# Altium schematic sheet gydrodrive_rs485.SchDoc
size 297 x 209 mm; SheetNumber: 14; SheetTotal: 22
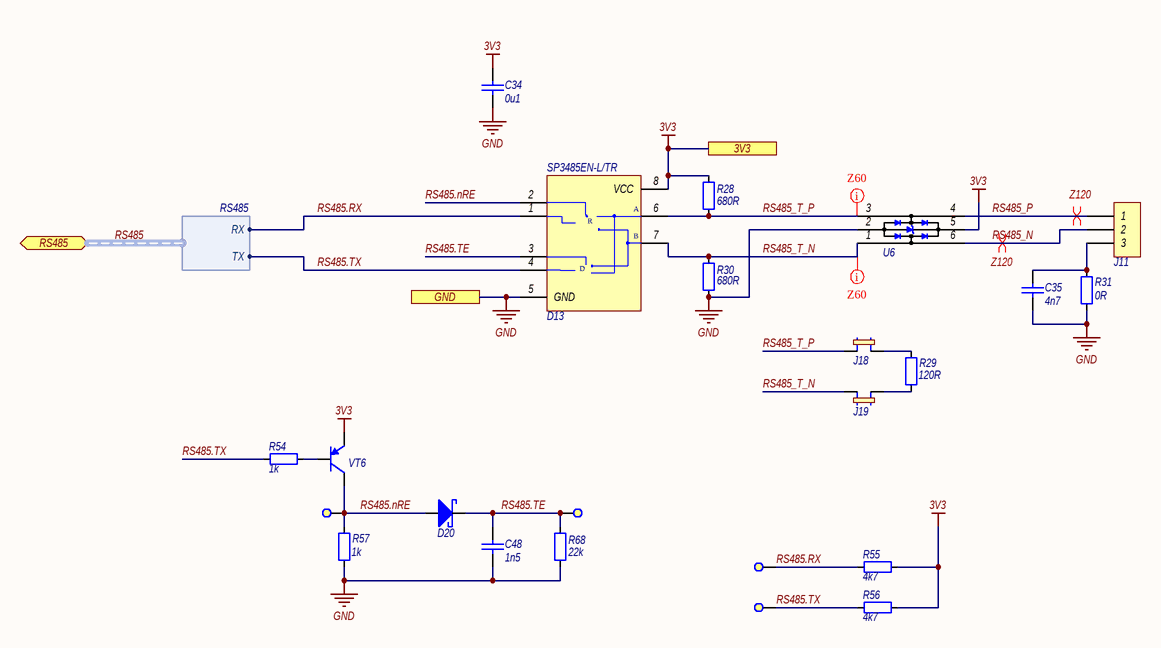
[diagram p0: gydrodrive_rs485.SchDoc]

## Parts
C34  Capacitance: 0u1  [CAPC2012-0805M]  (hidden comment: CAP_0805)
C35  Capacitance: 4n7  [CAPC3216-1206M]  (hidden comment: CAP_1206)
C48  Capacitance: 1n5  [CAPC2012-0805M]  (hidden comment: CAP_0805)
D13  SP3485EN-L/TR  [SO8_M]
D20  MBR0540  [SOD_123_M]  (value not drawn)
J11  DG142V-5.08-03P  [DG142V-5.08-03P]  (value not drawn)
J18  PLS-2.54-2 JUMP  [PLS-2-2.54]  (value not drawn)
J19  PLS-2.54-2 JUMP  [PLS-2-2.54]  (value not drawn)
R28  Resistance: 680R  [RESC3216-1206M]  (hidden comment: RES_1206)
R29  Resistance: 120R  [RESC3216-1206M]  (hidden comment: RES_1206)
R30  Resistance: 680R  [RESC3216-1206M]  (hidden comment: RES_1206)
R31  Resistance: 0R  [RESC3216-1206M]  (hidden comment: RES_1206)
R54  Resistance: 1k  [RESC2012-0805M]  (hidden comment: RES_0805)
R55  Resistance: 4k7  [RESC2012-0805M]  (hidden comment: RES_0805)
R56  Resistance: 4k7  [RESC2012-0805M]  (hidden comment: RES_0805)
R57  Resistance: 1k  [RESC2012-0805M]  (hidden comment: RES_0805)
R68  Resistance: 22k  [RESC2012-0805M]  (hidden comment: RES_0805)
TP1  Test point 1  [TP_1]  (value not drawn)  (no BOM)
TP10  Test point 1  [TP_1]  (value not drawn)  (no BOM)
TP11  Test point 1  [TP_1]  (value not drawn)  (no BOM)
TP19  Test point 1  [TP_1]  (value not drawn)  (no BOM)
U6  USBLC6-2SC6  [SOT23-6AM]  (value not drawn)
VT6  BC807  [SOT23-3M]  (value not drawn)

## Ports
3V3 (see gydrodrive_interfaces[3C], gydrodrive_button[2B], gydrodrive_can[2B], gydrodrive_debugger[2B], gydrodrive_encoder[1A], gydrodrive_indication[3C], gydrodrive_inputTrim[2B], gydrodrive_interfaces[3C], gydrodrive_mcu[4C], gydrodrive_sto[2B], gydrodrive_supply[3C]), GND (see gydrodrive_interfaces[3C], gydrodrive_button[2C], gydrodrive_can[2C], gydrodrive_control[2C], gydrodrive_currentSource[1B], gydrodrive_debugger[3C], gydrodrive_discreteControl[2B], gydrodrive_encoder[1B], gydrodrive_i2c[5C], gydrodrive_indication[3C], gydrodrive_inputTrim[2C], gydrodrive_interfaces[3A], gydrodrive_linearPosSensor[2C], gydrodrive_mcu[6D], gydrodrive_reservedPins[2C], gydrodrive_sensor[2C], gydrodrive_sensors[1B], gydrodrive_sto[2C], gydrodrive_supply[2C], gydrodrive_uart[4C]), RS485 (bidir, harness RS485, see gydrodrive_interfaces[4C], gydrodrive_mcu[1C])

## Harnesses
RS485: RX, TX

## Nets
3V3: C34.2 D13.8(VCC) R28.2 R55.1 R56.1 U6.5(Vbus) VT6.2(E) ; port 3V3
GND: C34.1 C35.1 C48.1 D13.5(GND) R30.1 R31.2 R57.1 R68.1 U6.2(GND) ; port GND
RS485.nRE: D13.2(~{RE}) D20.2(A) R57.2 TP19.1 VT6.3(C)
RS485.RX: D13.1(RO) R55.2 TP10.1 ; port RS485.RX
RS485.TE: C48.2 D13.3(DE) D20.1(K) R68.2 TP11.1
RS485.TX: D13.4(DI) R54.2 R56.2 TP1.1 ; port RS485.TX
RS485_N: J11.2 U6.6(IO1)
RS485_P: J11.1 U6.4(IO2)
RS485_T_N: D13.7(B) J19.2 R30.2 U6.1(IO1)
RS485_T_P: D13.6(A) J18.2 R28.1 U6.3(IO2)
NetC35_2: C35.2 J11.3 R31.1
NetJ18_1: J18.1 R29.2
NetJ19_1: J19.1 R29.1
NetR54_1: R54.1 VT6.1(B)

## Buses and harness runs
harness RS485 = port RS485

## Layout directives
differential pair; differential pair class Z120: RS485_N, RS485_P
net class Z60: RS485_T_N, RS485_T_P

## Notes on the sheet
- Подп. и дата
- Инв. № дубл.
- Взам. инв. №
- Инв. № подл.
- Изм.
- Лист
- № докум.
- Подп.
- Дата
- Копировал
- Формат
- A4
- (in symbol SP3485EN-L/TR) R; D

## Library data of the parts
C34 = CAPC_0805: Конденсатор керамический, корпус 0805; Parameters: 0u1,  50V; Voltage: 50V; Max Price: 5; Part Number: CAPC_0805; Part Name: ='Конд-р керам. 0805,  '  + Parameters; Component Type: Standart; Pin Count: 2
C35 = CAPC_1206: Конденсатор керамический, корпус 1206; Parameters: 4n7,  50V; Voltage: 50V; Max Price: 12; Part Number: CAPC_1206; Part Name: ='Конд-р керам. 1206,  '  + Parameters; Component Type: Standart; Pin Count: 2
C48 = CAPC_0805: Конденсатор керамический, корпус 0805; Parameters: 1n5,  50V; Voltage: 50V; Max Price: 5; Part Number: CAPC_0805; Part Name: ='Конд-р керам. 0805,  '  + Parameters; Component Type: Standart; Pin Count: 2
D13 = SP3485EN-L/TR: Дифференциальный приемопередатчик rs485; Part Name: Микросхема SP3485EN-L/TR; Parameters: 3V3; Max Price: 50; Part Number: SP3485EN-L/TR; Component Type: Standart
D20 = MBR0540: Диод Шоттки; Part Name: Диод Шоттки MBR0540; Parameters: 40V, 0.5A; Voltage: 40V; Current: 500mA; Max Price: 10; Part Number: MBR0540; Component Type: Standart; Pin Count: 2
J11 = DG142V-5.08-03P: Клеммник 3-контактный, шаг 5.08 мм; Part Name: Клеммник DG142V-5.08-03P; Parameters: 8А; Max Price: 60; System: Connector; Part Number: DG142V-5.08-03P; Component Type: Standart; Pin Count: 3
J18 J19 = PLS-2.54-2 JUMP: Разъем штыревой шаг 2.54 мм; Part Name: Разъем PLS-2, шаг 2.54 мм; Parameters: 2.54 мм; Max Price: 10; System: Connector; Part Number: PLS-2.54-2 JUMP; Component Type: Standart; Pin Count: 2
R28 R30 = RESC_1206: Рез-р, корпус 1206; Tolerance: 5%; Parameters: 680R, 5%; Max Price: 12; Part Number: RESC_1206; Part Name: ='Рез-р 1206, ' + Parameters; Component Type: Standart
R29 = RESC_1206: Рез-р, корпус 1206; Tolerance: 5%; Parameters: 120R, 5%; Max Price: 12; Part Number: RESC_1206; Part Name: ='Рез-р 1206, ' + Parameters; Component Type: Standart
R31 = RESC_1206: Рез-р, корпус 1206; Tolerance: 5%; Parameters: 0R, 5%; Max Price: 12; Part Number: RESC_1206; Part Name: ='Рез-р 1206, ' + Parameters; Component Type: Standart
R54 R57 = RESC_0805: Рез-р, корпус 0805; Tolerance: 5%; Parameters: 1k, 5%; Max Price: 3; Part Number: RESC_0805; Part Name: ='Рез-р 0805, ' + Parameters; Component Type: Standart
R55 R56 = RESC_0805: Рез-р, корпус 0805; Tolerance: 5%; Parameters: 4k7, 5%; Max Price: 3; Part Number: RESC_0805; Part Name: ='Рез-р 0805, ' + Parameters; Component Type: Standart
R68 = RESC_0805: Рез-р, корпус 0805; Tolerance: 5%; Parameters: 22k, 5%; Max Price: 3; Part Number: RESC_0805; Part Name: ='Рез-р 0805, ' + Parameters; Component Type: Standart
TP1 TP10 TP11 TP19 = Test point 1: Тестовый контакт круглый 1 мм; Part Number: Test point 1; Part Name: Тестовый контакт; Component Type: Standart (No BOM)
U6 = USBLC6-2SC6: Диодная сборка для защиты дифференциальной линии; Part Name: Диодная сборка USBLC6-2SC6; Parameters: 5.25V; Max Price: 30; Part Number: USBLC6-2SC6; Component Type: Standart; Pin Count: 6; Voltage: 5.25V
VT6 = BC807: Биполярный транзистор; Part Name: Транзистор BC807; Parameters: 45V, 0.5A; Voltage: 45V; Current: 500 mA; Max Price: 20; Part Number: BC807; Component Type: Standart